# Altium schematic sheet Power Supply.SchDoc
size A4; SheetNumber: 5; SheetTotal: 5
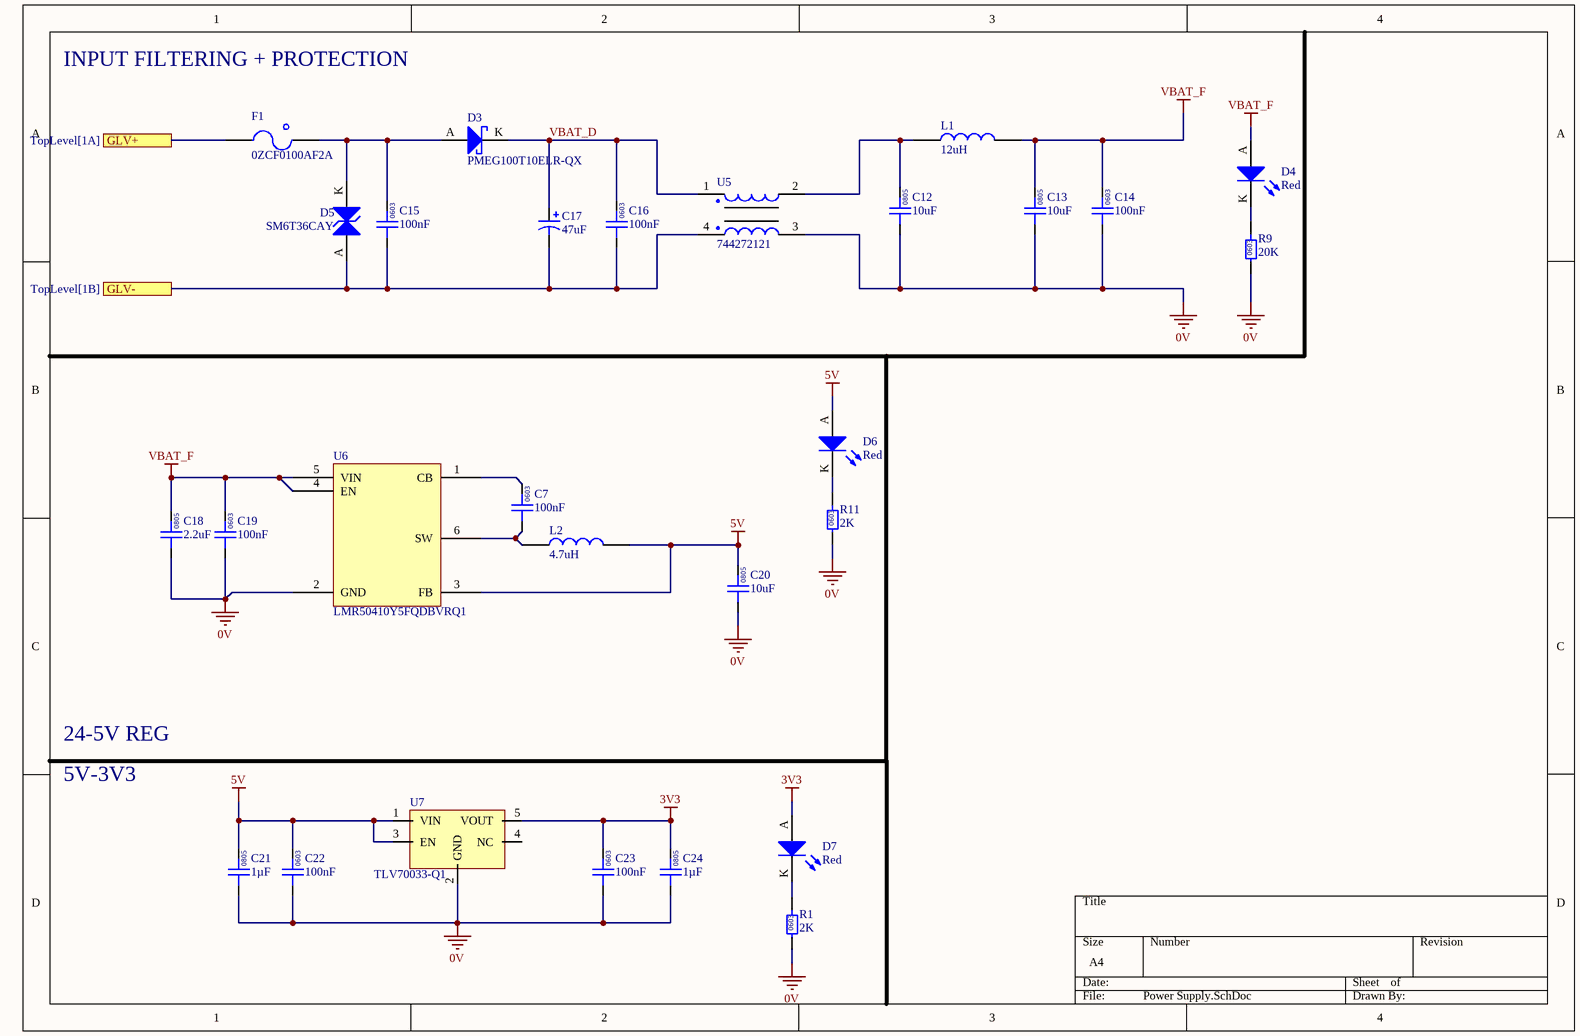
[diagram p0: Power Supply.SchDoc]

## Parts
C7  100nF  [0603]
C12  10uF  [0805]
C13  10uF  [0805]
C14  100nF  [0603]
C15  100nF  [0603]
C16  100nF  [0603]
C17  47uF  [CHEMI-CON ELCO]
C18  2.2uF  [0805]
C19  100nF  [0603]
C20  10uF  [0805]
C21  1µF  [0805]
C22  100nF  [0603]
C23  100nF  [0603]
C24  1µF  [0805]
D3  PMEG100T10ELR-QX  [NXP SOD123W]
D4  Red  [0805 LED]
D5  SM6T36CAY  [ST SMB DIODE]
D6  Red  [0805 LED]
D7  Red  [0805 LED]
F1  0ZCF0100AF2A  [2920]
L1  12uH  [1812]
L2  4.7uH  [SRN3015TA-4R7M]
R1  2K  [0603]
R9  20K  [0603]
R11  2K  [0603]
U5  744272121  [Wurth 4-PC Pad]
U6  LMR50410Y5FQDBVRQ1  [TI-SOT23-6]
U7  TLV70033-Q1  [TI SOT-23-5]

## Ports
GLV+ (see TopLevel[1A]), GLV- (see TopLevel[1B])

## Nets
0V: C12.1 C13.1 C14.1 C18.1 C19.1 C20.1 C21.1 C22.1 C23.1 C24.1 R1.1 R9.1 R11.1 U5.3 U6.2(GND) U7.2(GND)
3V3: C23.2 C24.2 D7.A U7.5(VOUT)
5V: C20.2 C21.2 C22.2 D6.A L2.1 U6.3(FB) U7.1(VIN) U7.3(EN)
VBAT_F: C13.2 C14.2 C18.2 C19.2 D4.A L1.1 U6.4(EN) U6.5(VIN)
GLV+: F1.1 ; port GLV+
GLV-: C15.1 C16.1 C17.1 D5.A U5.4 ; port GLV-
VBAT_D: C16.2 C17.2 D3.K U5.1
NetC7_1: C7.1 L2.2 U6.6(SW)
NetC7_2: C7.2 U6.1(CB)
NetC12_2: C12.2 L1.2 U5.2
NetC15_2: C15.2 D3.A D5.K F1.2
NetD4_K: D4.K R9.2
NetD6_K: D6.K R11.2
NetD7_K: D7.K R1.2

Not connected (* = marked no-connect by the designer): U7 4(NC)

## Notes on the sheet
- INPUT FILTERING + PROTECTION
- 5V-3V3
- 24-5V REG
- (in symbol GCM21BR71H105KA03L) 0805
- (in symbol GCM188L81H104KA57D) 0603
- (in symbol GRM21BR6YA106KE43L) 0805
- (in symbol GRM21BR71E225KE11L) 0805
- (in symbol RC0603FR-072KL) 0603
- (in symbol RC0603FR-0720KL) 0603

## Library data of the parts
C7 C14-C16 C19 C22 C23 = GCM188L81H104KA57D: Manufacturer: muRata; Rated Voltage: 50V; Tolerance: ±10%; Material: MLCC; Temperature Rating: X8L; Part Number: GCM188L81H104KA57D; Value: 100nF; Digikey Part Number: 490-6049-1-ND
C12 C13 C20 = GRM21BR6YA106KE43L: Manufacturer: muRata; Rated Voltage: 50V; Tolerance: 10%; Material: MLCC; Temperature Rating: X5R; Part Number: GRM21BR6YA106KE43L; Value: 10uF; Digikey Part Number: 490-10514-6-ND
C17 = HHXA350ARA470MF61G: Part Number: HHXA350ARA470MF61G
C18 = GRM21BR71E225KE11L: Manufacturer: Murata Electronics; Rated Voltage: 25V; Tolerance: ±10%; Material: MLCC; Temperature Rating: X7R; Part Number: GRM21BR71E225KE11L; Value: 2.2uF; Digikey Part Number: 490-14467-2-ND
C21 C24 = GCM21BR71H105KA03L: Manufacturer: muRata; Rated Voltage: 50V; Tolerance: ±10%; Material: MLCC; Temperature Rating: X7R; Part Number: GCM21BR71H105KA03L; Value: 1µF; Digikey Part Number: 490-10675-1-ND
D3 = PMEG100T10ELR-QX: Manufacturer: Nexperia USA Inc.; Forward Voltage: 0.75 V @ 1A; Breakdown Voltage: 100 V; Rated Power: 680 mW; Part Number: PMEG100T10ELR-QX; Digikey Part Number: 1727-PMEG100T10ELR-QXCT-ND
D4 D6 D7 = SML-210LTT86: Red LED Indication - Discrete 1.75V 0805 (2012 Metric); Manufacturer: ROHM Semiconductor; Part Number: SML-210LTT86; Colour: Red; Digikey Part Number: 511-1286-1-ND
D5 = SM6T36CAY: Manufacturer: STMicroelectronics; Breakdown Voltage: 30.8 V; Rated Power: 600W; Part Number: SM6T36CAY; Forward Voltage: 30.8 V; Digikey Part Number: 497-10804-1-ND
F1 = 0ZCF0100AF2A: PTC RESET FUSE 60V 1A 292; Manufacturer: Littelfuse Inc.; Part Number: 0ZCF0100AF2A; Digikey Part Number: 507-2070-1-ND; Digikey Link: https://www.digikey.com/product-detail/en/bel-fuse-inc/0ZCF0100AF2A/507-2070-1-ND/6210547
L1 = RLS-126: Manufacturer: Recom; Impedence: 230mOhm; Tolerance: 0.2; Material: Wirewound; Rated Current: 800mA; Part Number: RLS-126; Value: 12uH; Digikey Part Number: 945-3429-ND
L2 = SRN4018-4R7M: Manufacturer: Bourns; Tolerance: 0.2; Impedance: 84mOhms; Rated Current: 1.9A; Material: Wirewound; Part Number: SRN4018-4R7M; Value: 4.7uH; Digikey Part Number: SRN3015TA-4R7MCT-ND
R1 R11 = RC0603FR-072KL: Manufacturer: YAGEO; Tolerance: 0.01; Rated Power: 0.1W; Part Number: RC0603FR-072KL; Value: 2K; Digikey Part Number: 311-2.00KHRCT-ND; Material: FR-07
R9 = RC0603FR-0720KL: Manufacturer: YAGEO; Tolerance: 0.01; Rated Power: 0.1W; Part Number: RC0603FR-0720KL; Value: 20K; Digikey Part Number: 311-20.0KHRCT-ND; Material: FR-07
U5 = 744272121: Manufacturer: Wurth Electronics Inc; Value: 120uH @ 100kHz; Impedance: 460 Ohms @ 30MHz; Rated Current: 2.5 A; Part Number: 744272121; Material: Wirewound; Digikey Part Number: 732-1489-1-ND
U6 = LMR50410-Q1: IC REG BUCK 5V 1A SOT23-6; Manufacturer: Texas Instruments; Input Voltage: 4-36V; Part Number: LMR50410-Q1; Output Voltage: 5V; Output Current: 1A; Digikey Part Number: 296-LMR50410Y5FQDBVRQ1CT-ND
U7 = TLV70033-Q1: IC REG LINEAR 3.3V 200MA SOT23-5; Manufacturer: Texas Instruments; Input Voltage: 2 to 5.5 V; Output Current: 0.2 A; Part Number: TLV70033-Q1; Output Voltage: 3.3 V; Digikey Part Number: 296-27780-1-ND